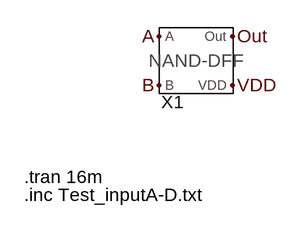
[diagram p0: schematic Test_NAND_DFF.asc]
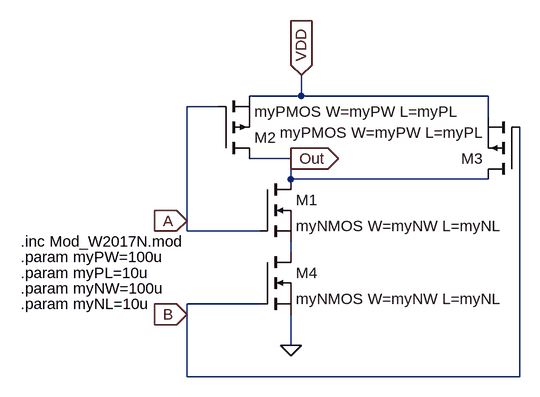
[diagram p1: sub-circuit gate_nand_dff.asc]
Test_NAND_DFF.asc, the LTspice schematic file:
Version 4
SHEET 1 880 680
FLAG 224 112 Out
FLAG 128 112 A
FLAG 128 176 B
FLAG 224 176 VDD
SYMBOL Gate_NAND_DFF 176 144 R0
SYMATTR InstName X1
TEXT -48 296 Left 2 !.tran 16m
TEXT -48 320 Left 2 !.inc Test_inputA-D.txt

gate_nand_dff.asc, the sub-circuit schematic file:
Version 4
SHEET 1 880 680
WIRE 64 -112 64 -144
WIRE 64 -112 -16 -112
WIRE 352 -112 64 -112
WIRE -64 -96 -112 -96
WIRE 352 -80 352 -112
WIRE 48 -16 -16 -16
WIRE 48 16 48 -16
WIRE 352 16 48 16
WIRE -112 80 -112 -96
WIRE -112 96 -112 80
WIRE 0 96 -112 96
WIRE 48 128 48 112
WIRE 0 208 -112 208
WIRE -112 224 -112 208
WIRE 48 272 48 224
WIRE -112 320 -112 224
WIRE 400 320 400 -64
WIRE 400 320 -112 320
FLAG 48 272 0
FLAG -112 80 A
IOPIN -112 80 In
FLAG -112 224 B
IOPIN -112 224 In
FLAG 48 -16 Out
IOPIN 48 -16 Out
FLAG 64 -144 VDD
IOPIN 64 -144 In
SYMBOL nmos 0 16 R0
SYMATTR InstName M1
SYMATTR Value myNMOS W=myNW L=myNL
SYMBOL pmos -64 -16 M180
SYMATTR InstName M2
SYMATTR Value myPMOS W=myPW L=myPL
SYMBOL pmos 400 16 R180
SYMATTR InstName M3
SYMATTR Value myPMOS W=myPW L=myPL
SYMBOL nmos 0 128 R0
SYMATTR InstName M4
SYMATTR Value myNMOS W=myNW L=myNL
TEXT -368 112 Left 2 !.inc Mod_W2017N.mod
TEXT -368 136 Left 2 !.param myPW=100u
TEXT -368 160 Left 2 !.param myPL=10u
TEXT -368 184 Left 2 !.param myNW=100u
TEXT -368 208 Left 2 !.param myNL=10u

The netlist it stands for:
* Test_NAND_DFF.asc
XX1 A B Out VDD gate_nand_dff

* block symbol definitions
.subckt gate_nand_dff A B Out VDD
M1 Out A N001 N001 myNMOS W=myNW L=myNL
M2 Out A VDD VDD myPMOS W=myPW L=myPL
M3 Out B VDD VDD myPMOS W=myPW L=myPL
M4 N001 B 0 0 myNMOS W=myNW L=myNL
.inc Mod_W2017N.mod
.param myPW=100u
.param myPL=10u
.param myNW=100u
.param myNL=10u
.ends gate_nand_dff

.model NMOS NMOS
.model PMOS PMOS
.lib standard.mos
.tran 16m
.inc Test_inputA-D.txt
.backanno
.end